# EAGLE schematic LWK2_Nokia5110 (EAGLE 7.6.0)
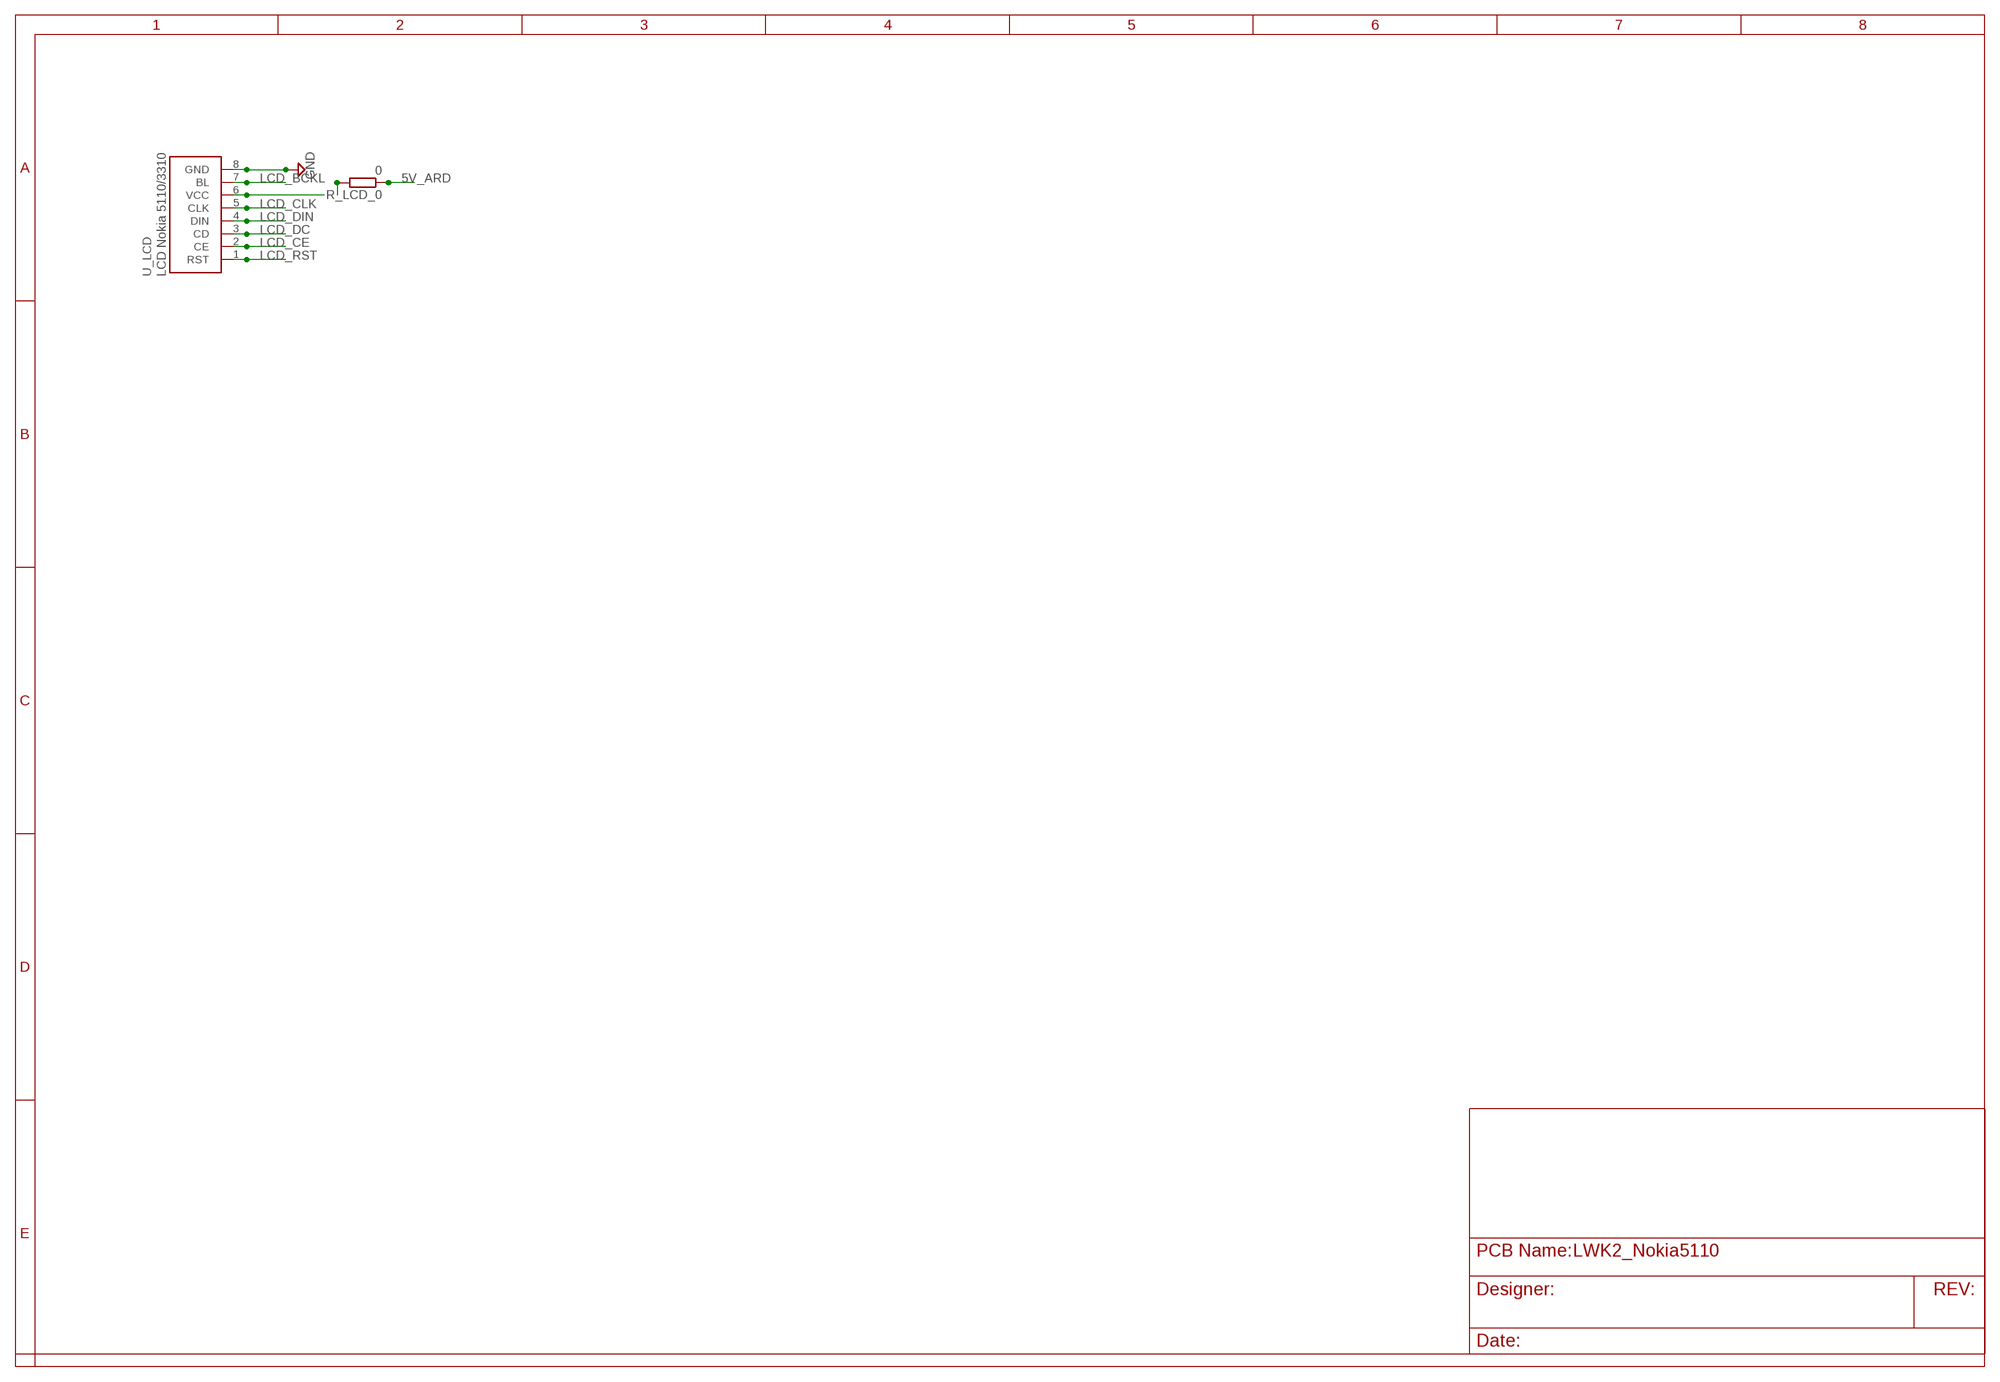
[diagram p0: schematic, sheet 1]

## Parts
R_LCD_0  0  R-EU_R1206  [R1206]
U_LCD  NOKIA5110  [NOKIA5110]

## Nets
5V_ARD: R_LCD_0.1
GND [GND]: U_LCD.8(GND)
LCD_BCKL: U_LCD.7(BL)
LCD_CE: U_LCD.2(CE)
LCD_CLK: U_LCD.5(CLK)
LCD_DC: U_LCD.3(CD)
LCD_DIN: U_LCD.4(DIN)
LCD_PW: U_LCD.6(VCC)
LCD_RST: U_LCD.1(RST)
N$5: R_LCD_0.2

## Library data of the parts
R_LCD_0 = resistor:R-EU_: RESISTOR, European symbol
U_LCD = _LCD_Nokia5110:NOKIA5110: Monochrome LCD Module from Nokia 5110/3310 with controller PCD8544. 8 pins x 2,54mm on bottom side. 45,5 mm x 42,5 mm

## Net classes
1 GND: width 0.635 mm
2 VCC: width 0.889 mm